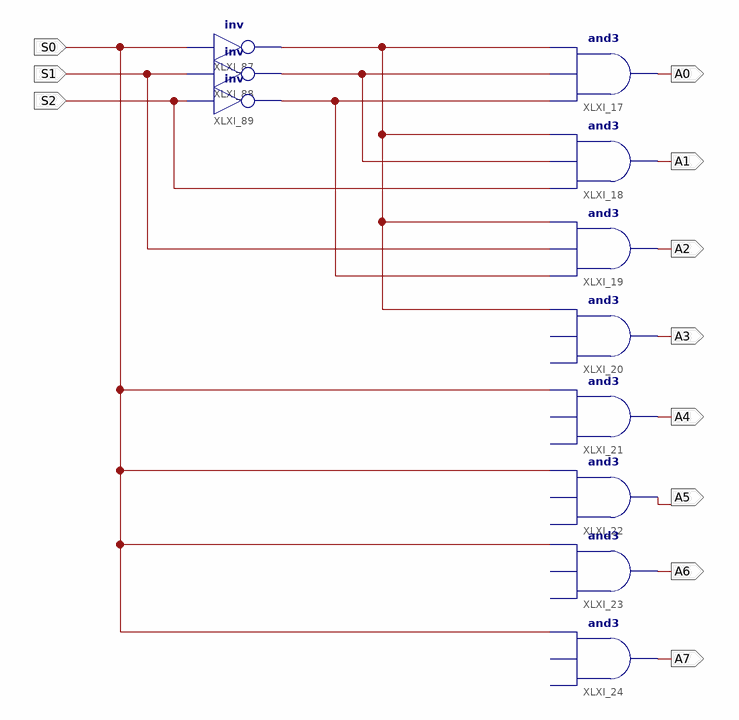
[diagram p0: schematic sheet 1]
// Xilinx ISE schematic Decoder_3_8.sch (spartan3e) as structural Verilog: 11 symbols, 11 ports
module Decoder_3_8 (
  input  S0,
  input  S1,
  input  S2,
  output A0,
  output A1,
  output A2,
  output A3,
  output A4,
  output A5,
  output A6,
  output A7
);

  wire XLXN_99, XLXN_100, XLXN_103;

  and XLXI_17 (A0, XLXN_103, XLXN_99, XLXN_100);
  and XLXI_18 (A1, S2, XLXN_99, XLXN_100);
  and XLXI_19 (A2, XLXN_103, S1, XLXN_100);
  buf XLXI_20 (A3, XLXN_100);  // and3 open: I0, I1
  buf XLXI_21 (A4, S0);  // and3 open: I0, I1
  buf XLXI_22 (A5, S0);  // and3 open: I0, I1
  buf XLXI_23 (A6, S0);  // and3 open: I0, I1
  buf XLXI_24 (A7, S0);  // and3 open: I0, I1
  not XLXI_87 (XLXN_100, S0);
  not XLXI_88 (XLXN_99, S1);
  not XLXI_89 (XLXN_103, S2);
endmodule
